# Altium project RcMPPT-BMS.PrjPcb
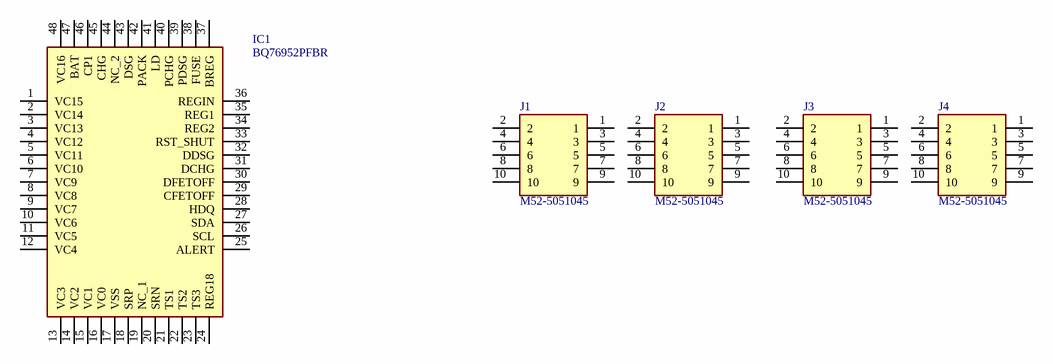
[diagram p0: RcMPPT-BMS.SchDoc]
1 sheet, 5 parts. Net scope: global (net labels, ports and power ports of the same name join across sheets).
Board file: RcMPPT-BMS.PcbDoc

## Sheet RcMPPT-BMS.SchDoc
size A4

### Parts
IC1  BQ76952PFBR  [QFP50P900X900X120-48N]
J1  M52-5051045  [M525051045]
J2  M52-5051045  [M525051045]
J3  M52-5051045  [M525051045]
J4  M52-5051045  [M525051045]

### Nets

Not connected (* = marked no-connect by the designer): IC1 1(VC15) 2(VC14) 3(VC13) 4(VC12) 5(VC11) 6(VC10) 7(VC9) 8(VC8) 9(VC7) 10(VC6) 11(VC5) 12(VC4) 13(VC3) 14(VC2) 15(VC1) 16(VC0) 17(VSS) 18(SRP) 19(NC_1) 20(SRN) 21(TS1) 22(TS2) 23(TS3) 24(REG18) 25(ALERT) 26(SCL) 27(SDA) 28(HDQ) 29(CFETOFF) 30(DFETOFF) 31(DCHG) 32(DDSG) 33(RST_SHUT) 34(REG2) 35(REG1) 36(REGIN) 37(BREG) 38(FUSE) 39(PDSG) 40(PCHG) 41(LD) 42(PACK) 43(DSG) 44(NC_2) 45(CHG) 46(CP1) 47(BAT) 48(VC16); J1 1 2 3 4 5 6 7 8 9 10; J2 1 2 3 4 5 6 7 8 9 10; J3 1 2 3 4 5 6 7 8 9 10; J4 1 2 3 4 5 6 7 8 9 10

### Notes on the sheet
- Title
- Size:
- Date:
- A4
- Number:
- Time:
- Revision:
- Sheet
- of
- File:

### Library data of the parts
IC1 = BQ76952PFBR: Integrated Circuit; Manufacturer_Name: Texas Instruments; Datasheet Link: https://www.ti.com/lit/ds/symlink/bq76952.pdf?ts=1602524050348&ref_url=https%253A%252F%252Fwww.ti.com%252Fproduct%252FBQ76952%253FkeyMatch%253DBQ76952PFBR%2526tisearch%253DSearch-EN-everything%2526usecase%253DOPN; Height: 1.2mm; Manufacturer_Part_Number: BQ76952PFBR
J1-J4 = M52-5051045: Connector; Manufacturer_Name: Harwin; Datasheet Link: https://cdn.harwin.com/pdfs/M52-505.pdf; Height: 5.7mm; Manufacturer_Part_Number: M52-5051045; Mouser Part Number: 855-M52-5051045; Mouser Price/Stock: https://www.mouser.co.uk/ProductDetail/Harwin/M52-5051045?qs=Jph8NoUxIfVdgQJihAwiug%3D%3D